# EAGLE schematic F1-T12_sensor (EAGLE 9.6.1)
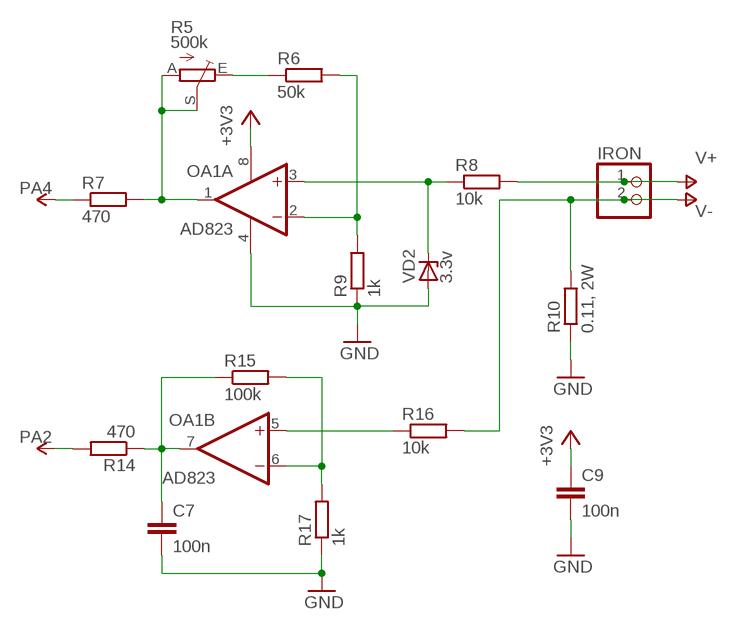
[diagram p0: schematic, sheet 1]

## Parts
C7  100n  C-EU025-025X050  [C025-025X050]
C9  100n  C-EU025-025X050  [C025-025X050]
IRON  PINHD-1X2  [1X02]
OA1  AD823  MCP602SN  [SO08]
R5  500k  TRIM_EU-B64Y  [B64Y]
R6  50k  R-EU_0204/5  [0204/5]
R7  470  R-EU_0204/5  [0204/5]
R8  10k  R-EU_0204/5  [0204/5]
R9  1k  R-EU_0204/5  [0204/5]
R10  0.11, 2W  R-EU_0204/5  [0204/5]
R14  470  R-EU_0204/5  [0204/5]
R15  100k  R-EU_0204/5  [0204/5]
R16  10k  R-EU_0204/5  [0204/5]
R17  1k  R-EU_0204/5  [0204/5]
VD2  3.3v  ZENER-DIODEDO34-7  [DO34Z7]

## Nets
+3V3: C9.1 OA1.8(P:V+)
GND: C7.2 C9.2 R10.1 R17.1
N$12: R5.E R6.1
N$14: OA1.2(A:-IN) R6.2 R9.2
N$15: OA1.3(A:+IN) R8.1 VD2.C
N$18: C7.1 OA1.7(B:OUT) R14.1 R15.1
N$19: OA1.6(B:-IN) R15.2 R17.2
N$20: OA1.1(A:OUT) R5.A R5.S R7.2
N$22: OA1.5(B:+IN) R16.1
V+: IRON.1 R8.2
V-: IRON.2 R10.2 R16.2
VCCA: R7.1 ; supply symbol labelled PA4
VD3: OA1.4(P:V-) R9.1 VD2.A ; supply symbol labelled GND
VDD: R14.2 ; supply symbol labelled PA2

## Library data of the parts
C7 C9 = rcl:C-EU: CAPACITOR, European symbol; SPICEPREFIX: C
IRON = pinhead:PINHD-1X2: PIN HEADER
OA1 = linear:MCP602: Single Op Amp 2.7V to 6.0V Single Supply CMOS Source: http://ww1.microchip.com/downloads/en/DeviceDoc/21314g.pdf
R5 = pot:TRIM_EU-: POTENTIOMETER
R6-R10 R14-R17 = rcl:R-EU_: RESISTOR, European symbol; SPICEPREFIX: R
VD2 = diode:ZENER-DIODE: Z-Diode